# Altium schematic sheet PiMX8MP_BRIDGE_FPC.SchDoc: PiMX8MP Bridge FPC
size 420 x 297 mm; Author: T. Ludemann; SheetNumber: 1; SheetTotal: 1; DocSize: DINA3
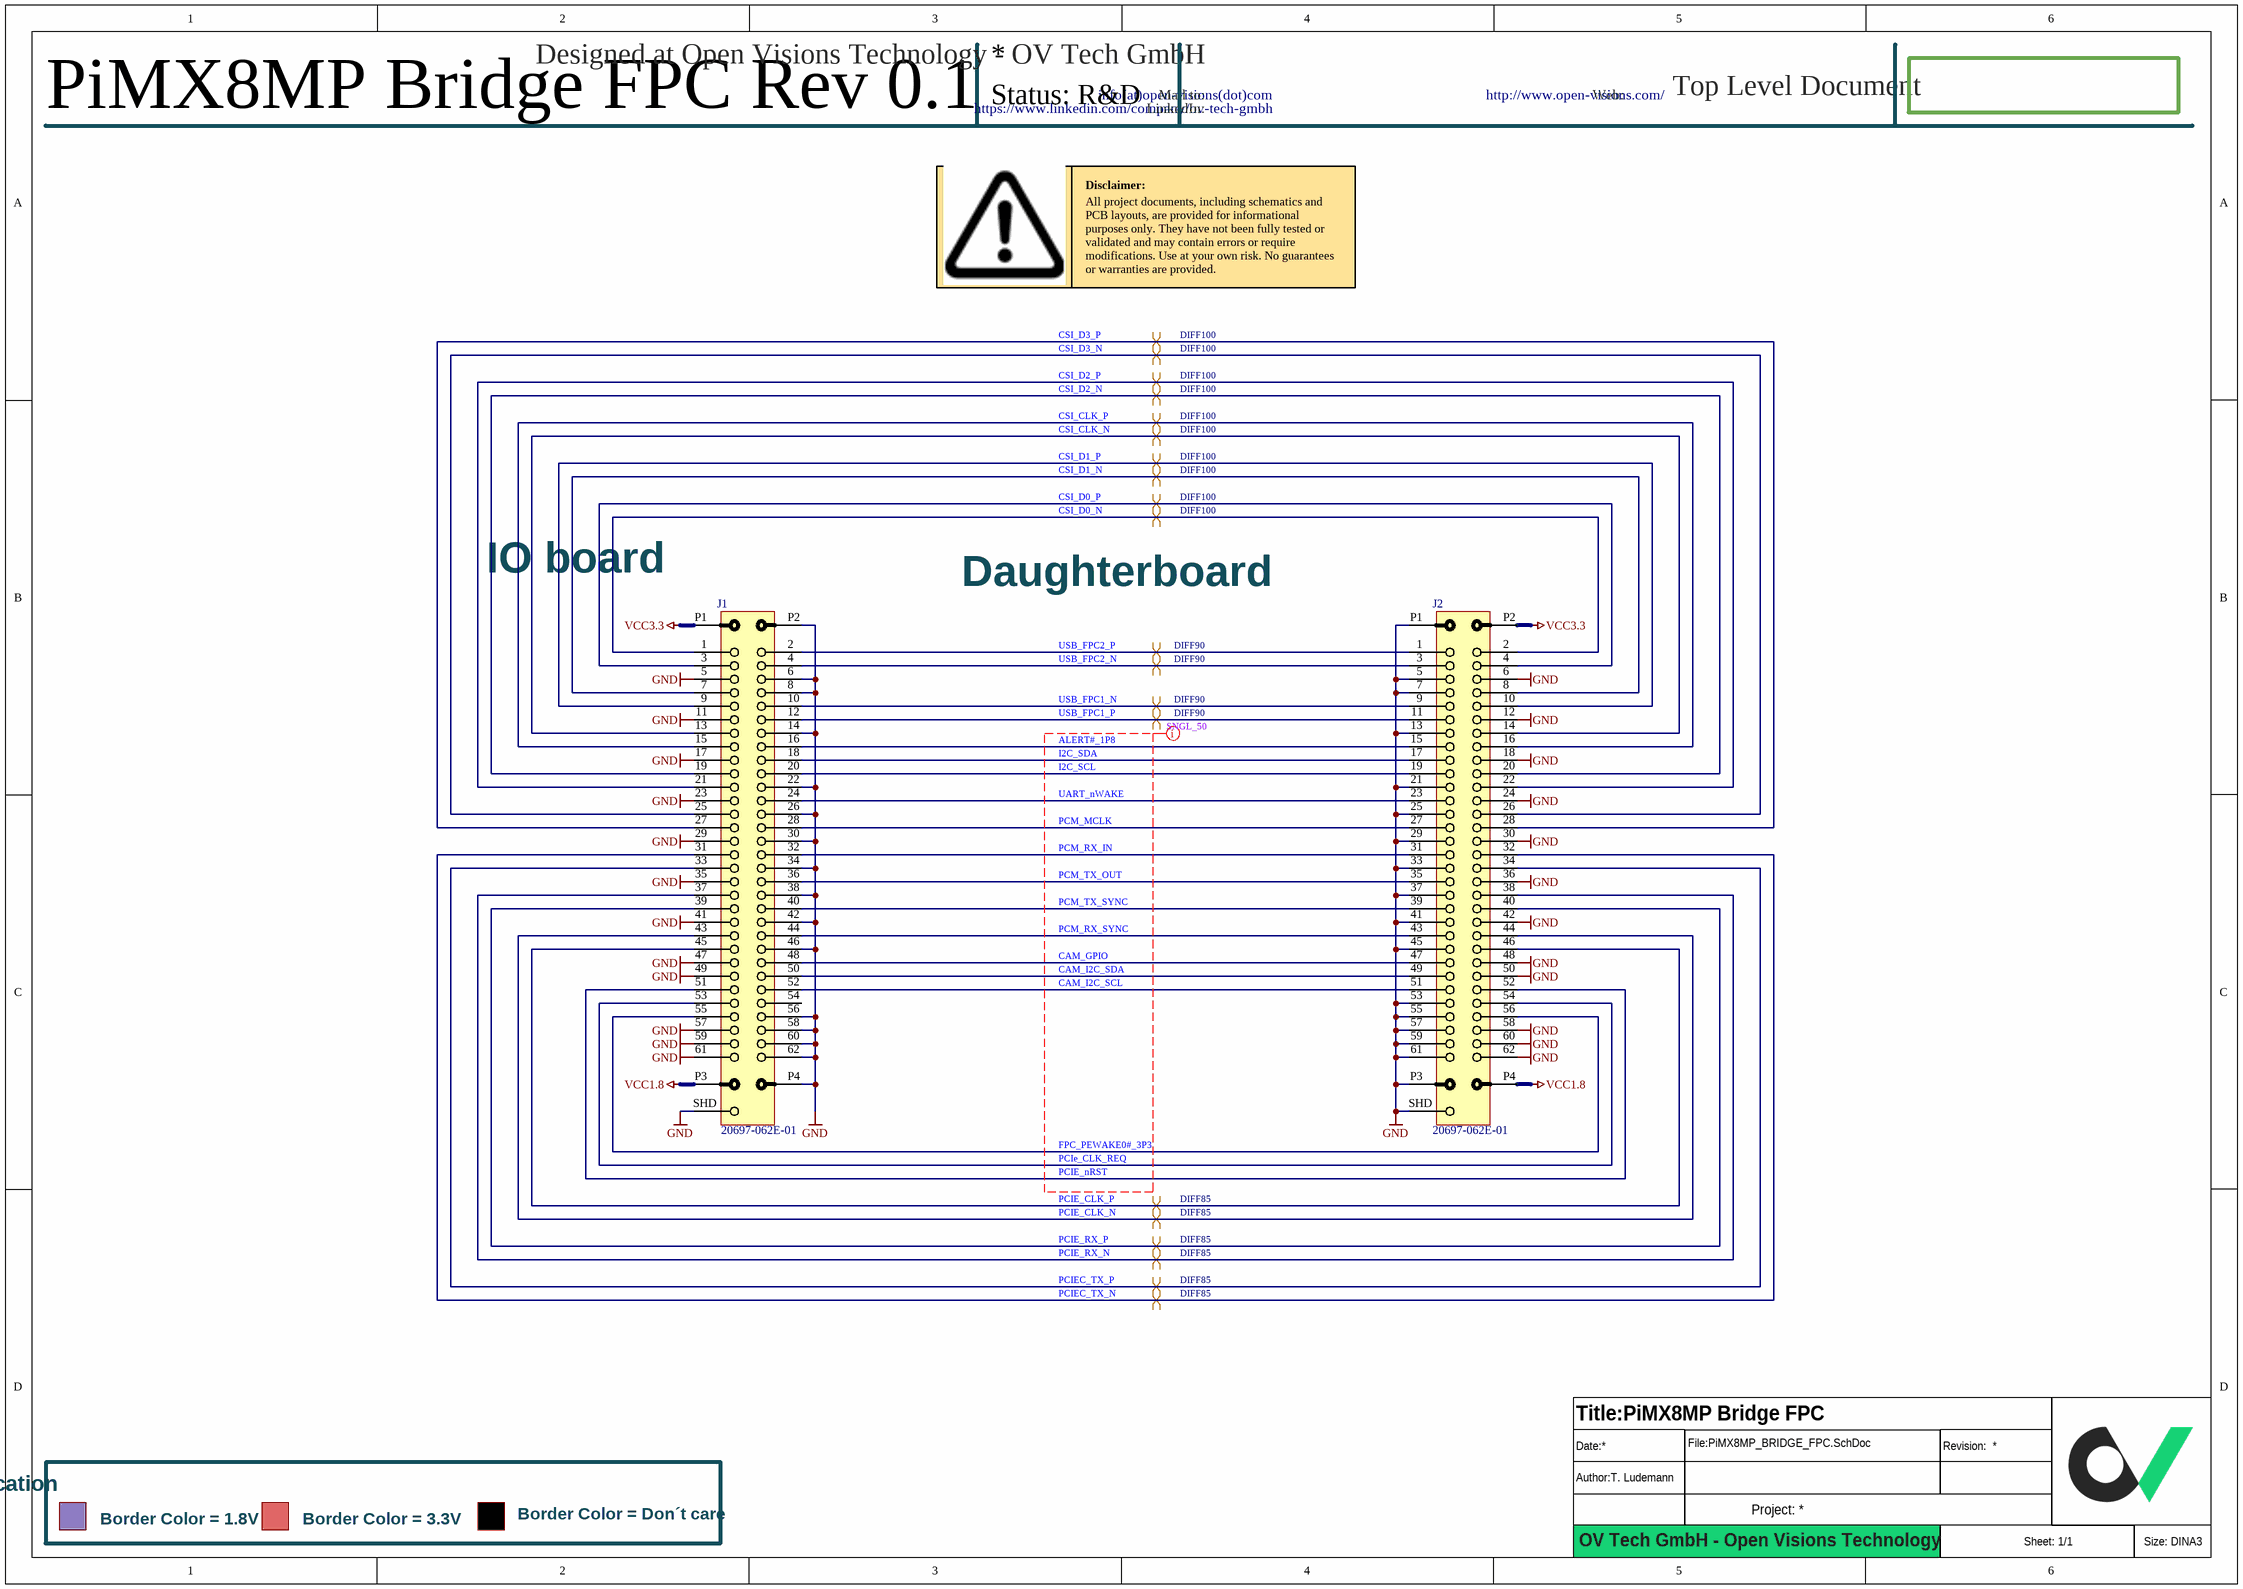
[diagram p0: PiMX8MP_BRIDGE_FPC.SchDoc]

## Parts
?  (no value)  (graphical)
J1  20697-062E-01  [BOARD-TO-BOARD 62POL_20697-062E-01]
J2  20697-062E-01  [BOARD-TO-BOARD 62POL_20697-062E-01]

## Nets
GND: J1.5 J1.6 J1.8 J1.11 J1.14 J1.17 J1.22 J1.23 J1.26 J1.29 J1.30 J1.34 J1.35 J1.38 J1.41 J1.42 J1.46 J1.47 J1.49 J1.56 J1.57 J1.58 J1.59 J1.60 J1.61 J1.62 J1.P2 J1.P4 J1.SHD J2.5 J2.6 J2.7 J2.12 J2.13 J2.18 J2.21 J2.24 J2.25 J2.29 J2.30 J2.33 J2.36 J2.37 J2.41 J2.42 J2.45 J2.48 J2.50 J2.53 J2.55 J2.57 J2.58 J2.59 J2.60 J2.61 J2.62 J2.P1 J2.P3 J2.SHD
VCC1.8: J1.P3 J2.P4
VCC3.3: J1.P1 J2.P2
ALERT#_1P8: J1.16 J2.15
CAM_GPIO: J1.48 J2.47
CAM_I2C_SCL: J1.52 J2.51
CAM_I2C_SDA: J1.50 J2.49
CSI_CLK_N: J1.13 J2.14
CSI_CLK_P: J1.15 J2.16
CSI_D0_N: J1.1 J2.2
CSI_D0_P: J1.3 J2.4
CSI_D1_N: J1.7 J2.8
CSI_D1_P: J1.9 J2.10
CSI_D2_N: J1.19 J2.20
CSI_D2_P: J1.21 J2.22
CSI_D3_N: J1.25 J2.26
CSI_D3_P: J1.27 J2.28
FPC_PEWAKE0#_3P3: J1.55 J2.56
I2C_SCL: J1.20 J2.19
I2C_SDA: J1.18 J2.17
PCIE_CLK_N: J1.43 J2.44
PCIE_CLK_P: J1.45 J2.46
PCIe_CLK_REQ: J1.53 J2.54
PCIE_nRST: J1.51 J2.52
PCIE_RX_N: J1.37 J2.38
PCIE_RX_P: J1.39 J2.40
PCIEC_TX_N: J1.31 J2.32
PCIEC_TX_P: J1.33 J2.34
PCM_MCLK: J1.28 J2.27
PCM_RX_IN: J1.32 J2.31
PCM_RX_SYNC: J1.44 J2.43
PCM_TX_OUT: J1.36 J2.35
PCM_TX_SYNC: J1.40 J2.39
UART_nWAKE: J1.24 J2.23
USB_FPC1_N: J1.10 J2.9
USB_FPC1_P: J1.12 J2.11
USB_FPC2_N: J1.4 J2.3
USB_FPC2_P: J1.2 J2.1

Not connected (* = marked no-connect by the designer): J1 54

## Layout directives
differential pair; differential pair class DIFF90: USB_FPC1_N, USB_FPC1_P, USB_FPC2_N, USB_FPC2_P
differential pair; differential pair class DIFF100: CSI_CLK_N, CSI_CLK_P, CSI_D0_N, CSI_D0_P, CSI_D1_N, CSI_D1_P, CSI_D2_N, CSI_D2_P, CSI_D3_N, CSI_D3_P
differential pair; differential pair class DIFF85: PCIE_CLK_N, PCIE_CLK_P, PCIE_RX_N, PCIE_RX_P, PCIEC_TX_N, PCIEC_TX_P
net class SNGL_50: ALERT#_1P8, CAM_GPIO, CAM_I2C_SCL, CAM_I2C_SDA, FPC_PEWAKE0#_3P3, I2C_SCL, I2C_SDA, PCIe_CLK_REQ, PCIE_nRST, PCM_MCLK, PCM_RX_IN, PCM_RX_SYNC, PCM_TX_OUT, PCM_TX_SYNC, UART_nWAKE

## Notes on the sheet
- PiMX8MP Bridge FPC Rev 0.1
- Status: R&D
- Designed at Open Visions Technology - OV Tech GmbH
- Mail to:
- LinkedIn:
- info(at)open-visions(dot)com
- https://www.linkedin.com/company/ov-tech-gmbh
- Web:
- http://www.open-visions.com/
- Top Level Document
- Disclaimer:
- All project documents, including schematics and PCB layouts, are provided for informational purposes only. They have not been fully tested or validated and may contain errors or require modifications. Use at your own risk. No guarantees or warranties are provided.
- (near J1) IO board
- (near J2) Daughterboard
- Signal Level Indication
- Border Color = 1.8V
- Border Color = 3.3V
- Border Color = Don´t care
- OV Tech GmbH - Open Visions Technology

## Library data of the parts
? = Titleblock_01_OpenSource
J1 J2 = Board to Board Connector_62pol_20697-062E-01: Board to Board connector plug 62Pol FPC Header 0.35mm Pitch; Manufacturer 1: I-PEX; Manufacturer 1 Prt. Nr.: 20697-062E-01